# Altium schematic sheet Input Mode Selector.SchDoc
size A4; CompanyName: Technische Hochschule Nürnberg Georg Simon Ohm; Organization: UltraZohm; Address1: Kesslerplatz 12; Address2: 90489 Nürnberg; Address3: GERMANY; DocumentNumber: 8; SheetNumber: 8; SheetTotal: 12; Website: www.ultrazohm.com
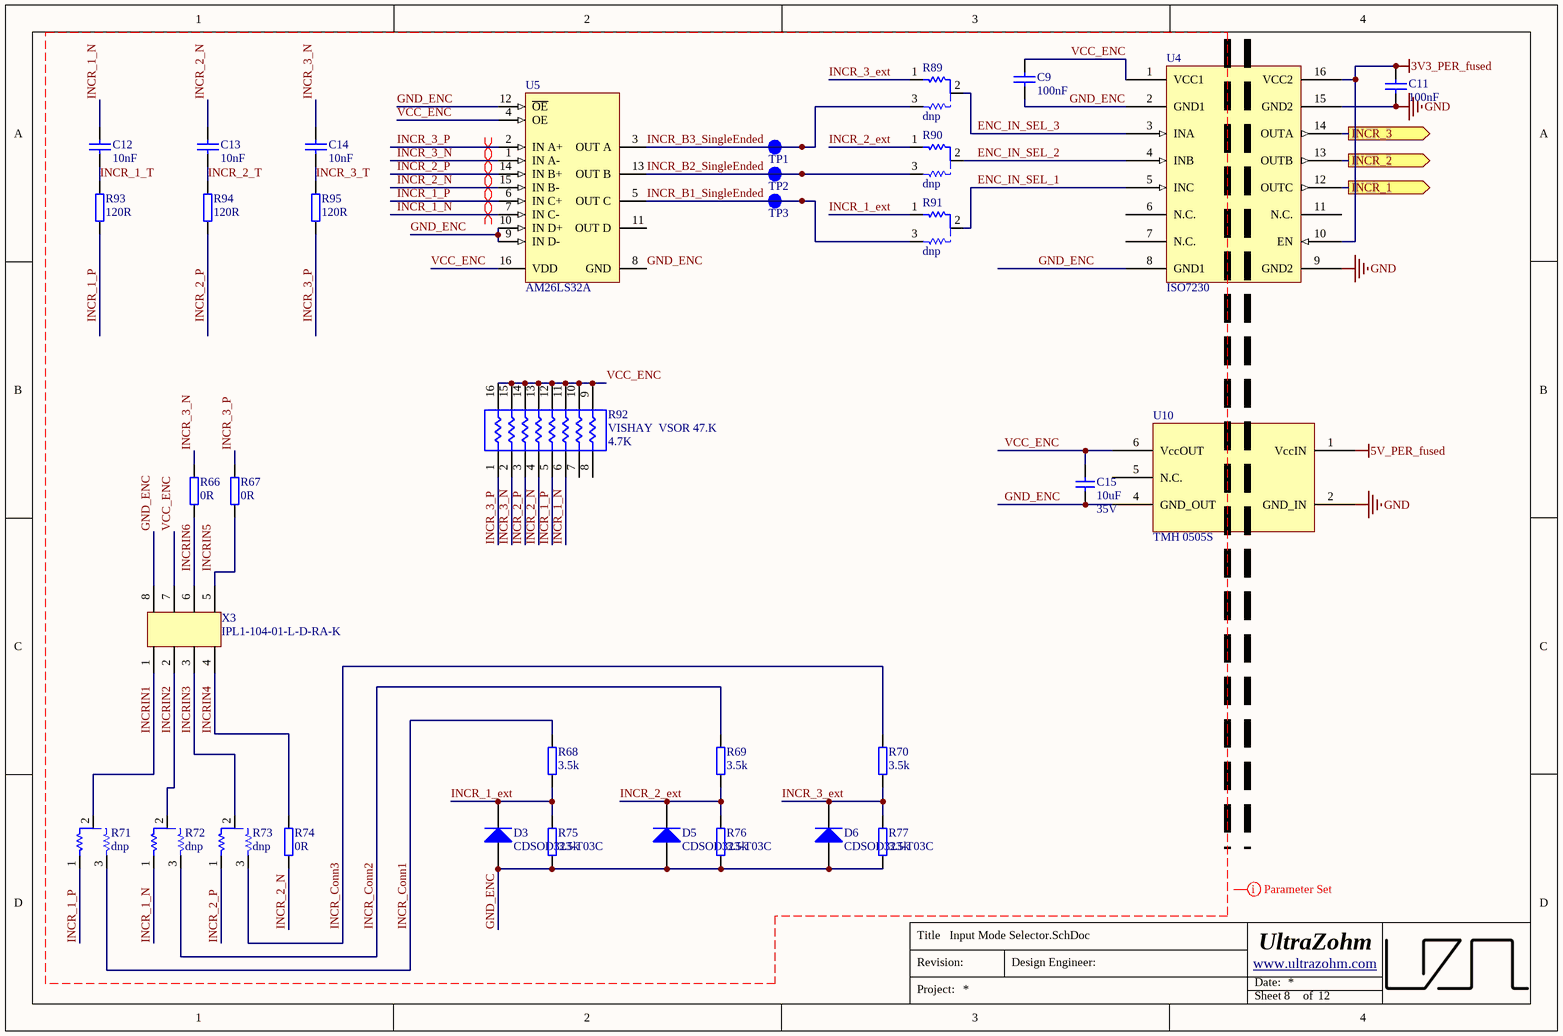
[diagram p0: Input Mode Selector.SchDoc]

## Parts
C9  100nF  [CAPC1608X07N]
C11  100nF  [CAPC1608X07N]
C12  10nF  [CAPC1608X07N]
C13  10nF  [CAPC1608X07N]
C14  10nF  [CAPC1608X07N]
C15  10uF  Voltage: 35V  [C_1206]
D3  CDSOD323-T03C  [SOD-323]
D5  CDSOD323-T03C  [SOD-323]
D6  CDSOD323-T03C  [SOD-323]
R66  0R  [RESC1608X06N]
R67  0R  [RESC1608X06N]
R68  3.5k  [RESC1608X06N]
R69  3.5k  [RESC1608X06N]
R70  3.5k  [RESC1608X06N]
R71  dnp  [0603_Config]
R72  dnp  [0603_Config]
R73  dnp  [0603_Config]
R74  0R  [RESC1608X06N]
R75  3.5k  [RESC1608X06N]
R76  3.5k  [RESC1608X06N]
R77  3.5k  [RESC1608X06N]
R89  dnp  [0603_Config]
R90  dnp  [0603_Config]
R91  dnp  [0603_Config]
R92  VISHAY  VSOR 47.K  value 4.7K  [SO-16_N]
R93  120R  [RESC1608X06N]
R94  120R  [RESC1608X06N]
R95  120R  [RESC1608X06N]
TP1  VCC  [TP_1mm]  (value not drawn)
TP2  VCC  [TP_1mm]  (value not drawn)
TP3  VCC  [TP_1mm]  (value not drawn)
U4  ISO7230  [SOIC-16_wide-body]
U5  AM26LS32A  [M16A_N]
U10  TMH 0505S  [SIL-6(7)]
X3  IPL1-104-01-L-D-RA-K  [Conector 4x2 TH Horizontal]

## Ports
INCR_1 (out), INCR_2 (out), INCR_3 (out)

## Nets
3V3_PER_fused: C11.2 U4.10(EN) U4.16(VCC2)
5V_PER_fused: U10.1(VccIN)
GND: C11.1 U4.9(GND2) U4.15(GND2) U10.2(GND_IN)
ENC_IN_SEL_1: R91.2 U4.5(INC)
ENC_IN_SEL_2: R90.2 U4.4(INB)
ENC_IN_SEL_3: R89.2 U4.3(INA)
GND_ENC: C9.1 C15.1 D3.2(A) D5.2(A) D6.2(A) R75.2 R76.2 R77.2 U4.2(GND1) U4.8(GND1) U5.8(GND) U5.9(IN_D-) U5.10(IN_D+) U5.12(~{OE}) U10.4(GND_OUT) X3.8
INCR_1: U4.12(OUTC) ; port INCR_1
INCR_1_ext: D3.1(K) R68.2 R75.1 R91.1
INCR_1_N: C12.2 R72.1 R92.6 U5.7(IN_C-)
INCR_1_P: R71.1 R92.5 R93.1 U5.6(IN_C+)
INCR_1_T: C12.1 R93.2
INCR_2: U4.13(OUTB) ; port INCR_2
INCR_2_ext: D5.1(K) R69.2 R76.1 R90.1
INCR_2_N: C13.2 R74.1 R92.4 U5.15(IN_B-)
INCR_2_P: R73.1 R92.3 R94.1 U5.14(IN_B+)
INCR_2_T: C13.1 R94.2
INCR_3: U4.14(OUTA) ; port INCR_3
INCR_3_ext: D6.1(K) R70.2 R77.1 R89.1
INCR_3_N: C14.2 R66.2 R92.2 U5.1(IN_A-)
INCR_3_P: R67.2 R92.1 R95.1 U5.2(IN_A+)
INCR_3_T: C14.1 R95.2
INCR_B1_SingleEnded: R91.3 TP3.1 U5.5(OUT_C)
INCR_B2_SingleEnded: R90.3 TP2.1 U5.13(OUT_B)
INCR_B3_SingleEnded: R89.3 TP1.1 U5.3(OUT_A)
INCR_Conn1: R68.1 R71.3
INCR_Conn2: R69.1 R72.3
INCR_Conn3: R70.1 R73.3
INCRIN1: R71.2 X3.1
INCRIN2: R72.2 X3.2
INCRIN3: R73.2 X3.3
INCRIN4: R74.2 X3.4
INCRIN5: R67.1 X3.5
INCRIN6: R66.1 X3.6
VCC_ENC: C9.2 C15.2 R92.9 R92.10 R92.11 R92.12 R92.13 R92.14 R92.15 R92.16 U4.1(VCC1) U5.4(OE) U5.16(VDD) U10.6(VccOUT) X3.7

Not connected (* = marked no-connect by the designer): R92 7 8; U4 6(N.C.) 7(N.C.) 11(N.C.); U5 11(OUT_D); U10 5(N.C.)

## Layout directives
differential pair: INCR_1_N, INCR_1_P, INCR_2_N, INCR_2_P, INCR_3_N, INCR_3_P
net class isol_incre: (no net found under the mark)

## Notes on the sheet
- Title
- Revision:
- Design Engineer:
- Date:
- Project:
- Sheet
- of

## Library data of the parts
C9 C11 = Cap_0603: MPN: 885012206071; MF: Würth; Voltage: 25V; Value: 100nF; Supplier 1: Mouser; Supplier 2: *; Supplier Part Number 1: 710-885012206071; Supplier Part Number 2: *
C12-C14 = Cap_0603: MPN: 885012206065; MF: Würth; Voltage: 25V; Value: 10nF; Supplier 1: Mouser; Supplier 2: *; Supplier Part Number 1: 710-885012206065; Supplier Part Number 2: *
C15 = C_1206: Capacitor 1206; MPN: GRM319R6YA106KA12D; Tolerance: 10%; MF: Murata Electronics; Dielectric: X5R; Package: 1206; Value: 10uF; Created: 2018_06_25_AGeiger; Supplier 1: Mouser; Supplier Part Number 1: 81-GRM319R6YA106KA2D
D3 D5 D6 = Diodo TVS: TVS DIODE 3.3V 19V SOD323; MF: Bourns; Supplier Part Number 2: CDSOD323-T03CCT-ND; MPN: CDSOD323-T03C; Supplier Part Number 1: 652-CDSOD323-T03C; Package: SOD-323-2; Supplier 2: Digi-Key; Supplier 1: Mouser
R66 R67 R74 = R_0603: MPN: CRCW06030000Z0EAC; MF: Vishay; Value: 0R; Supplier 1: Mouser; Supplier Part Number 1: 71-CRCW06030000Z0EAC
R68-R70 R75-R77 R93-R95 = R_0603: MF: *; MPN: *; Supplier 1: *; Supplier Part Number 1: *
  R68-R70 R75-R77: Value: 3.5k
  R93-R95: Value: 120R
R71-R73 R89-R91 = R_config: Solder 0603 resistor/jumper between pads 1 and 2 for standard function. Solter resistor between pads 2 and 3 for alternative function; MPN: MCWR06X1002FTL; Value: 0R; MF: Multicomp; Voltage: 50V; Power: 100mW; Tolerance: 1%; Created: 2018_09_04_AGeiger; Package: 0603; Supplier Part Number 1: 2447230; Supplier 1: Farnell
R92 = Res Pack3: Isolated Resistor Network; Published: 24-Mar-1999; LatestRevisionDate: 29-May-2009; LatestRevisionNote: IPC-7351 Footprint Added.; PackageReference: SO-16; Publisher: Altium Limited; PackageDescription: 16-Pin Small Outline Integrated Circuit 1.27 mm Pitch; Code_JEDEC: MS-012-AC; Code_IPC: SOIC127P600-16
TP1-TP3 = TP_1mm: Testpoint 1mm; Created: 2018_06_25_AGeiger; Value: Testpoint 1mm
U4 = TI ISO7230: High-Speed, Triple-Channel Digital Isolator; Supplier 1: Mouser; Supplier Part Number 1: 595-ISO7230CDWR
U5 = DS26LS32CM: Quad Differential Line Receiver, 16-pin Narrow SOIC; PartNumber: AM26LS32AIDR; Manufacturer: TI; CompType: Interface IC; Published: 4-Dec-2008; Supplier 1: Mouser; Supplier Part Number 1: 595-AM26LS32AIDR; PinCount: 16; ComponentLink3Description: M16A Package Page; ComponentLink3URL: http://www.national.com/packaging/folders/m16a.html
U10 = TRACO TMH 0505S: 5V/5V DC-DC Isolation Converter
X3 = Conector 4x2 Horizontal: CONN HEADER R/A 8POS 2.54MM Through Hole; MF: Samtec; Supplier Part Number 2: SAM9596-ND; MPN: IPL1-104-01-L-D-RA-K; Supplier Part Number 1: 200-IPL110401LDRAK; Supplier 1: Mouser; Supplier 2: Digi-Key